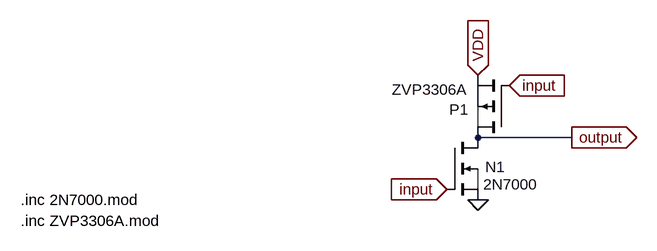
[diagram p0: schematic Inverter.asc]
Inverter.asc, the LTspice schematic file:
Version 4.1
SHEET 1 1152 680
WIRE 496 208 496 176
WIRE 640 224 496 224
WIRE 496 304 496 272
FLAG 496 320 0
FLAG 544 144 input
IOPIN 544 144 In
FLAG 448 304 input
IOPIN 448 304 In
FLAG 640 224 output
IOPIN 640 224 Out
FLAG 496 128 VDD
IOPIN 496 128 In
SYMBOL nmos4 448 224 R0
WINDOW 0 59 45 Left 2
SYMATTR InstName N1
SYMATTR Value 2N7000
SYMATTR Prefix X
SYMBOL pmos 544 224 R180
WINDOW 0 63 43 Left 2
WINDOW 3 64 74 Left 2
SYMATTR InstName P1
SYMATTR Value ZVP3306A
SYMATTR Prefix X
TEXT -208 320 Left 2 !.inc 2N7000.mod
TEXT -208 352 Left 2 !.inc ZVP3306A.mod

The netlist it stands for:
* Inverter.asc
X§N1 output input 0 N002 2N7000  ; pins D G S B
X§P1 output input VDD ZVP3306A  ; pins D G S
.inc 2N7000.mod
.inc ZVP3306A.mod
.backanno
.end